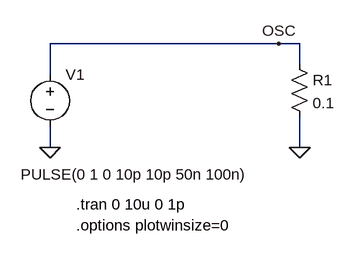
[diagram p0: schematic harmonic_03_pulse_no_lpf.asc]
harmonic_03_pulse_no_lpf.asc, the LTspice schematic file:
Version 4
SHEET 1 880 680
WIRE 352 64 0 64
WIRE 384 64 352 64
WIRE 384 96 384 64
WIRE 0 112 0 64
WIRE 0 224 0 192
WIRE 384 224 384 176
FLAG 0 224 0
FLAG 384 224 0
FLAG 352 64 OSC
SYMBOL voltage 0 96 R0
WINDOW 3 -45 170 Left 2
WINDOW 123 0 0 Left 0
WINDOW 39 0 0 Left 0
SYMATTR Value PULSE(0 1 0 10p 10p 50n 100n)
SYMATTR InstName V1
SYMBOL res 368 80 R0
SYMATTR InstName R1
SYMATTR Value 0.1
TEXT 40 312 Left 2 !.tran 0 10u 0 1p
TEXT 40 344 Left 2 !.options plotwinsize=0

The netlist it stands for:
* harmonic_03_pulse_no_lpf.asc
V1 OSC 0 PULSE(0 1 0 10p 10p 50n 100n)
R1 OSC 0 0.1
.tran 0 10u 0 1p
.options plotwinsize=0
.backanno
.end